# EasyEDA schematic first.json
TITLE: Sheet_1; REV: 1.0; Date: 2024-07-30; Sheet: 1/1; Drawn By: qweenjon; Company: Your Company
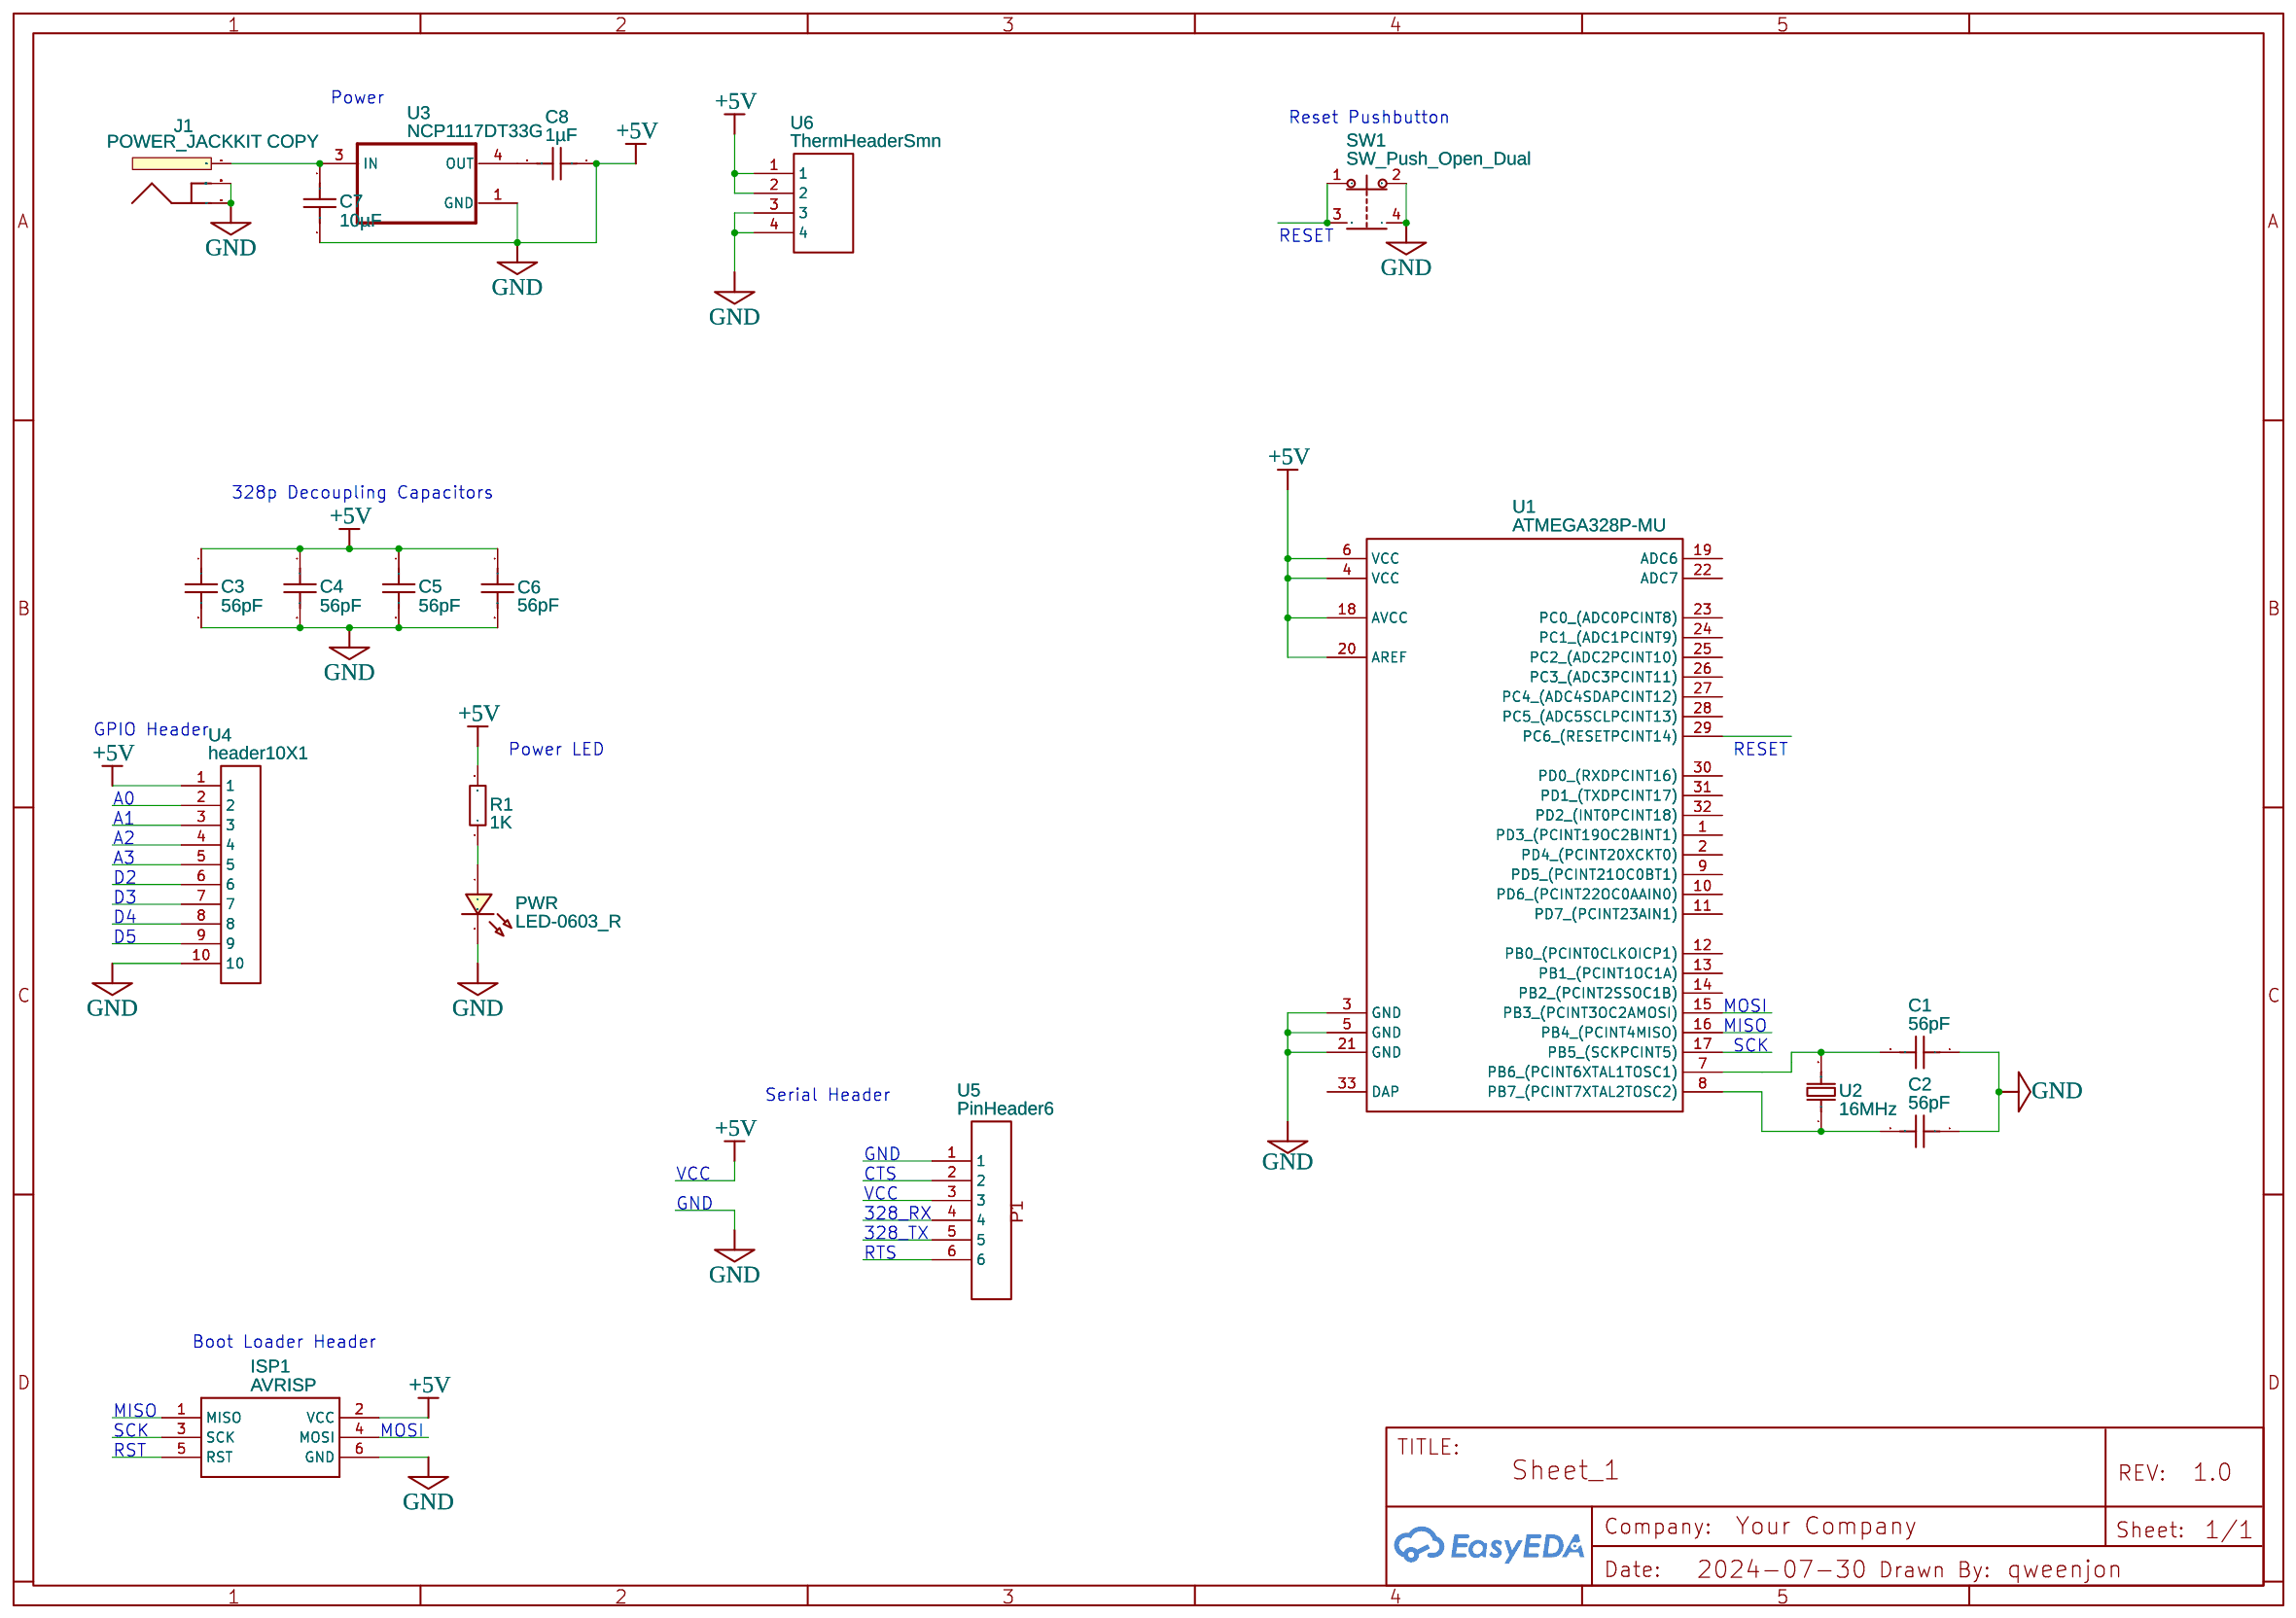
[diagram p0: schematic sheet]

## Parts
C1  56pF  [C0805]
C2  56pF  [C0805]
C3  56pF  [C0805]
C4  56pF  [C0805]
C5  56pF  [C0805]
C6  56pF  [C0805]
C7  10µF  [C0805]
C8  1µF  [C0805]
ISP1  AVRISP  [AVRISP]
J1  POWER_JACKKIT COPY  [POWER-BARRELJACK-PTH-LOCK-KIT]
PWR  LED-0603_R  [LED0603_RED]
R1  1K  [0805]
SW1  SW_Push_Open_Dual
U1  ATMEGA328P-MU  [HQFN-32_L5.0-W5.0-P0.50-BL-EP3.0]
U2  16MHz  [CRYSTAL-SMD_L4.5-W2.0]
U3  NCP1117DT33G  [VREG_NCP1117DT33G]
U4  header10X1  [HEADER10X1]
U5  PinHeader6  [PINHEADER6]
U6  ThermHeaderSmn  [THERMHEADER4]

## Library data of the parts
C1-C8 = TCC0805C0G560J101BT: Contributor: LCSC; Supplier: LCSC; Supplier Part: C282705; Manufacturer: CCTC(三环); Manufacturer Part: TCC0805COG560J101BT; JLCPCB Part Class: Extended Part
ISP1 = AVRISP: Contributor: Adafruit
J1 = POWER_JACKKIT COPY: Contributor: liran
PWR = LED-0603_R: Manufacturer: EVERLIGHT(台湾亿光); Manufacturer Part: 19-217/R6C-AL1M2VY/3T; Supplier Part: C72044; Supplier: LCSC; Contributor: LCEDA_01
R1 = Resistor 0805: Supplier: LCSC; Supplier Part: C351618; Manufacturer: ResistorToday; Manufacturer Part: PTFR0805B110RN9; Contributor: LCSC
SW1 = SW_Push_Open_Dual: Contributor: Gerardo BARBERO
U1 = ATMEGA328P-MU: Contributor: 立创EDA官方封装库; Supplier: LCSC; Manufacturer: null; Supplier Part: C38896; JLCPCB Part Class: Extended Part
U2 = EFO-PS5004E5: Supplier: LCSC; Supplier Part: C6033328; Manufacturer: PANASONIC(松下); JLCPCB Part Class: Extended Part; Contributor: lcsc
U3 = NCP1117DT33G: Contributor: DeepWater
U4 = header10X1: Contributor: lgw3897
U5 = PinHeader6: Contributor: AmrW.
U6 = ThermHeaderSmn: Contributor: velinazim0776

## Nets
+5V: C1.1 C2.1 C3.1 C3.2 C4.1 C4.2 C5.1 C5.2 C6.1 C6.2 C7.2 C8.1 ISP1.2(VCC) ISP1.6(GND) J1.GND J1.GNDBREAK PWR.2 R1.2 SW1.2 SW1.4 U1.3(GND) U1.4(VCC) U1.5(GND) U1.6(VCC) U1.18(AVCC) U1.20(AREF) U1.21(GND) U3.1(GND) U4.1 U4.10 U6.1 U6.2 U6.3 U6.4
Net-(C1-2): C1.2 U1.7(PB6 (PCINT6XTAL1TOSC1)) U2.2
Net-(C2-2): C2.2 U1.8(PB7 (PCINT7XTAL2TOSC2)) U2.1
Net-(C7-1): C7.1 J1.PWR U3.3(IN)
Net-(C8-2): C8.2 U3.4(OUT)
Net-(PWR-1): PWR.1 R1.1
Net-(SW1-1): SW1.1 SW1.3

Not connected (* = marked no-connect by the designer): ISP1 1(MISO) 3(SCK) 4(MOSI) 5(RST); U1 1(PD3 (PCINT19OC2BINT1)) 2(PD4 (PCINT20XCKT0)) 9(PD5 (PCINT21OC0BT1)) 10(PD6 (PCINT22OC0AAIN0)) 11(PD7 (PCINT23AIN1)) 12(PB0 (PCINT0CLKOICP1)) 13(PB1 (PCINT1OC1A)) 14(PB2 (PCINT2SSOC1B)) 15(PB3 (PCINT3OC2AMOSI)) 16(PB4 (PCINT4MISO)) 17(PB5 (SCKPCINT5)) 19(ADC6) 22(ADC7) 23(PC0 (ADC0PCINT8)) 24(PC1 (ADC1PCINT9)) 25(PC2 (ADC2PCINT10)) 26(PC3 (ADC3PCINT11)) 27(PC4 (ADC4SDAPCINT12)) 28(PC5 (ADC5SCLPCINT13)) 29(PC6 (RESETPCINT14)) 30(PD0 (RXDPCINT16)) 31(PD1 (TXDPCINT17)) 32(PD2 (INT0PCINT18)) 33(DAP); U4 2 3 4 5 6 7 8 9; U5 1 2 3 4 5 6

## Notes on the sheet
- Power
- Reset Pushbutton
- RESET
- 328p Decoupling Capacitors
- GPIO Header
- Power LED
- RESET
- A0
- A1
- A2
- A3
- D2
- D3
- D4
- D5
- MOSI
- MISO
- SCK
- Serial Header
- VCC
- CTS
- GND
- VCC
- GND
- 328_RX
- 328_TX
- RTS
- Boot Loader Header
- MISO
- SCK
- MOSI
- RST
